# Altium project MISIS_Commutator.PrjPcb
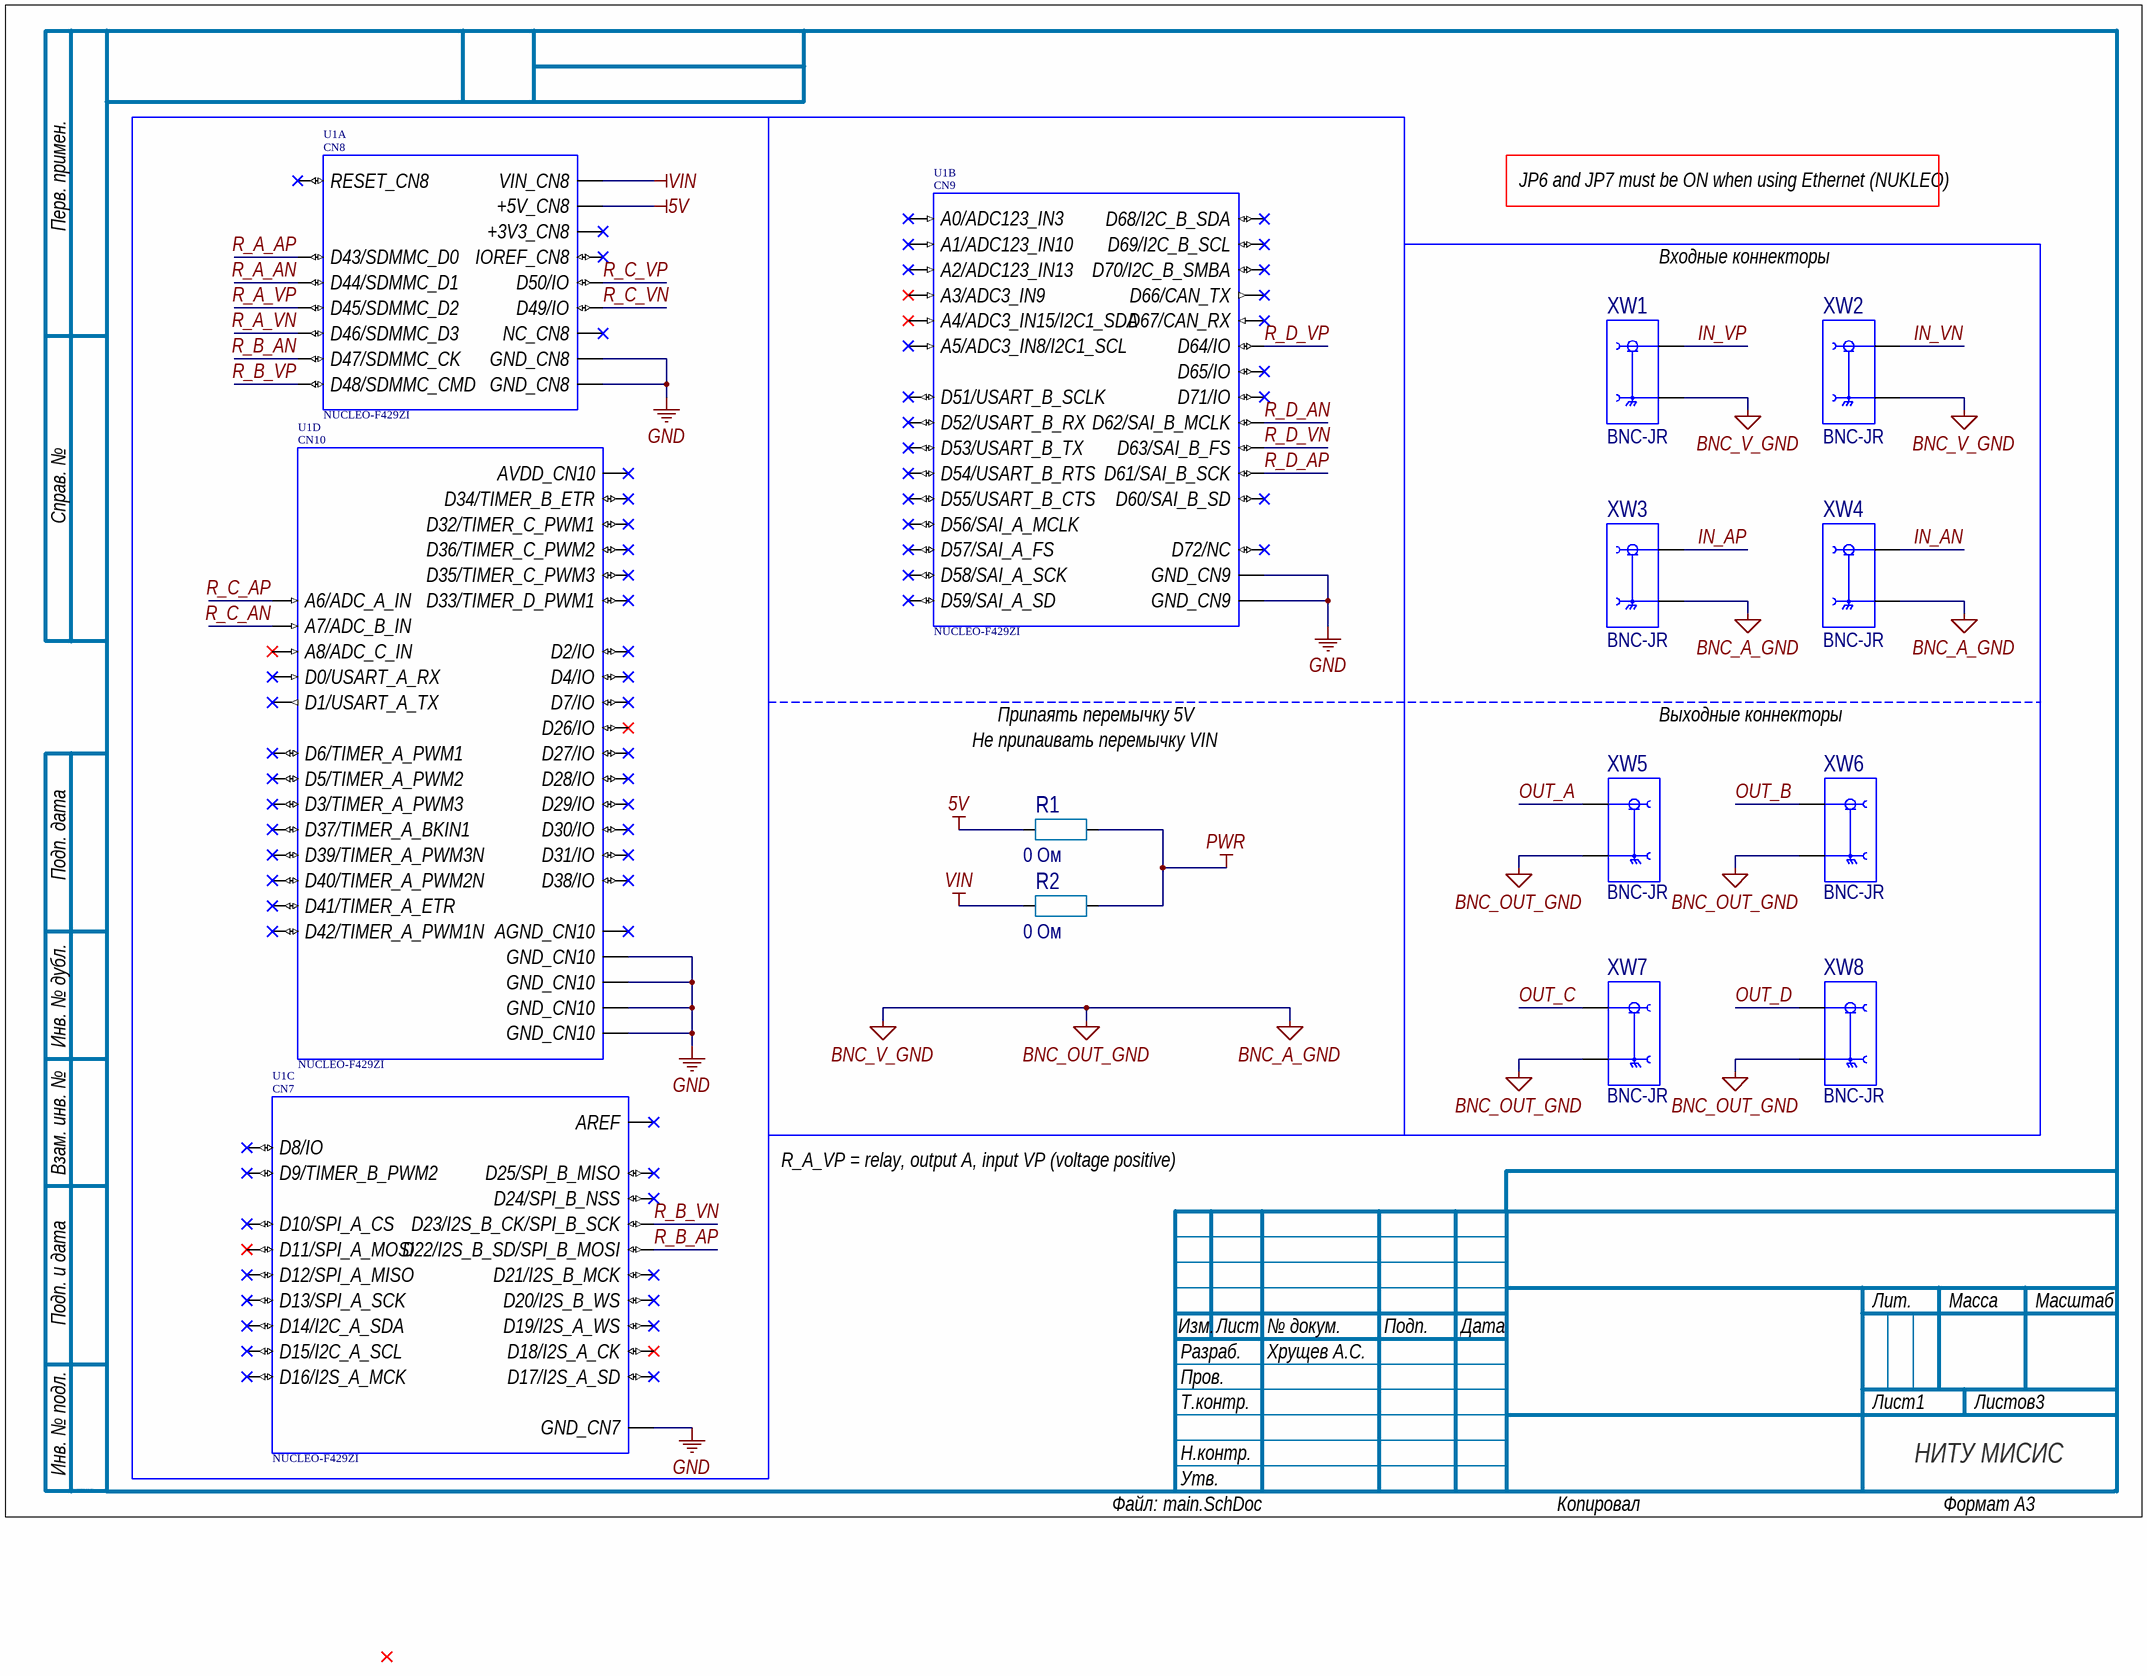
[diagram p0: main.SchDoc]
3 sheets, 75 parts. Net scope: global (net labels, ports and power ports of the same name join across sheets).
Board file: PCB.PcbDoc
Sheets:
  main.SchDoc
  IN_A.SchDoc
  IN_V.SchDoc

## Sheet main.SchDoc
size 420 x 297 mm; Author: ALTIUM GOSTBOM2.0 KEV; SheetNumber: 1; SheetTotal: 3; Наименование_организации: НИТУ МИСИС; п_Разраб_Р: Хрущев А.С.

### Parts
R1  0 Ом  [R0805]
R2  0 Ом  [R0805]
U1  NUCLEO-F429ZI  [MODULE_NUCLEO-F429ZI]  (parts A,B,C,D of 4)
XW1  BNC-JR  [TE_227161-1]
XW2  BNC-JR  [TE_227161-1]
XW3  BNC-JR  [TE_227161-1]
XW4  BNC-JR  [TE_227161-1]
XW5  BNC-JR  [TE_227161-1]
XW6  BNC-JR  [TE_227161-1]
XW7  BNC-JR  [TE_227161-1]
XW8  BNC-JR  [TE_227161-1]

### Nets
5V: R1.1 U1.CN8_9(+5V_CN8)
BNC_A_GND: XW1.2(GND) XW2.2(GND) XW3.2(GND) XW4.2(GND) XW5.2(GND) XW6.2(GND) XW7.2(GND) XW8.2(GND)  [also labelled BNC_OUT_GND, BNC_V_GND]
GND: U1.CN7_8(GND_CN7) U1.CN8_11(GND_CN8) U1.CN8_13(GND_CN8) U1.CN9_12(GND_CN9) U1.CN9_23(GND_CN9) U1.CN10_5(GND_CN10) U1.CN10_17(GND_CN10) U1.CN10_22(GND_CN10) U1.CN10_27(GND_CN10)
PWR: R1.2 R2.2
VIN: R2.1 U1.CN8_15(VIN_CN8)
IN_AN: XW4.1(SIG)
IN_AP: XW3.1(SIG)
IN_VN: XW2.1(SIG)
IN_VP: XW1.1(SIG)
OUT_A: XW5.1(SIG)
OUT_B: XW6.1(SIG)
OUT_C: XW7.1(SIG)
OUT_D: XW8.1(SIG)
R_A_AN: U1.CN8_4(D44/SDMMC_D1)
R_A_AP: U1.CN8_2(D43/SDMMC_D0)
R_A_VN: U1.CN8_8(D46/SDMMC_D3)
R_A_VP: U1.CN8_6(D45/SDMMC_D2)
R_B_AN: U1.CN8_10(D47/SDMMC_CK)
R_B_AP: U1.CN7_13(D22/I2S_B_SD/SPI_B_MOSI)
R_B_VN: U1.CN7_15(D23/I2S_B_CK/SPI_B_SCK)
R_B_VP: U1.CN8_12(D48/SDMMC_CMD)
R_C_AN: U1.CN10_9(A7/ADC_B_IN)
R_C_AP: U1.CN10_7(A6/ADC_A_IN)
R_C_VN: U1.CN8_14(D49/IO)
R_C_VP: U1.CN8_16(D50/IO)
R_D_AN: U1.CN9_26(D62/SAI_B_MCLK)
R_D_AP: U1.CN9_24(D61/SAI_B_SCK)
R_D_VN: U1.CN9_28(D63/SAI_B_FS)
R_D_VP: U1.CN9_30(D64/IO)

Not connected (* = marked no-connect by the designer): U1 CN7_1(D16/I2S_A_MCK)* CN7_2(D15/I2C_A_SCL)* CN7_3(D17/I2S_A_SD)* CN7_4(D14/I2C_A_SDA)* CN7_5(D18/I2S_A_CK)* CN7_6(AREF)* CN7_7(D19/I2S_A_WS)* CN7_9(D20/I2S_B_WS)* CN7_10(D13/SPI_A_SCK)* CN7_11(D21/I2S_B_MCK)* CN7_12(D12/SPI_A_MISO)* CN7_14(D11/SPI_A_MOSI)* CN7_16(D10/SPI_A_CS)* CN7_17(D24/SPI_B_NSS)* CN7_18(D9/TIMER_B_PWM2)* CN7_19(D25/SPI_B_MISO)* CN7_20(D8/IO)* CN8_1(NC_CN8)* CN8_3(IOREF_CN8)* CN8_5(RESET_CN8)* CN8_7(+3V3_CN8)* CN9_1(A0/ADC123_IN3)* CN9_2(D51/USART_B_SCLK)* CN9_3(A1/ADC123_IN10)* CN9_4(D52/USART_B_RX)* CN9_5(A2/ADC123_IN13)* CN9_6(D53/USART_B_TX)* CN9_7(A3/ADC3_IN9)* CN9_8(D54/USART_B_RTS)* CN9_9(A4/ADC3_IN15/I2C1_SDA)* CN9_10(D55/USART_B_CTS)* CN9_11(A5/ADC3_IN8/I2C1_SCL)* CN9_13(D72/NC)* CN9_14(D56/SAI_A_MCLK)* CN9_15(D71/IO)* CN9_16(D57/SAI_A_FS)* CN9_17(D70/I2C_B_SMBA)* CN9_18(D58/SAI_A_SCK)* CN9_19(D69/I2C_B_SCL)* CN9_20(D59/SAI_A_SD)* CN9_21(D68/I2C_B_SDA)* CN9_22(D60/SAI_B_SD)* CN9_25(D67/CAN_RX)* CN9_27(D66/CAN_TX)* CN9_29(D65/IO)* CN10_1(AVDD_CN10)* CN10_2(D7/IO)* CN10_3(AGND_CN10)* CN10_4(D6/TIMER_A_PWM1)* CN10_6(D5/TIMER_A_PWM2)* CN10_8(D4/IO)* CN10_10(D3/TIMER_A_PWM3)* CN10_11(A8/ADC_C_IN)* CN10_12(D2/IO)* CN10_13(D26/IO)* CN10_14(D1/USART_A_TX)* CN10_15(D27/IO)* CN10_16(D0/USART_A_RX)* CN10_18(D42/TIMER_A_PWM1N)* CN10_19(D28/IO)* CN10_20(D41/TIMER_A_ETR)* CN10_21(D29/IO)* CN10_23(D30/IO)* CN10_24(D40/TIMER_A_PWM2N)* CN10_25(D31/IO)* CN10_26(D39/TIMER_A_PWM3N)* CN10_28(D38/IO)* CN10_29(D32/TIMER_C_PWM1)* CN10_30(D37/TIMER_A_BKIN1)* CN10_31(D33/TIMER_D_PWM1)* CN10_32(D36/TIMER_C_PWM2)* CN10_33(D34/TIMER_B_ETR)* CN10_34(D35/TIMER_C_PWM3)*

### Notes on the sheet
- JP6 and JP7 must be ON when using Ethernet (NUKLEO)
- Входные коннекторы
- Не припаивать перемычку VIN
- Припаять перемычку 5V
- Выходные коннекторы
- R_A_VP = relay, output A, input VP (voltage positive)
- Перв. примен.
- Справ. №
- Подп. дата
- Инв. № дубл.
- Взам. инв. №
- Подп. и дата
- Изм.
- Разраб.
- Лист
- № докум.
- Подп.
- Дата
- Лит.
- Масса
- Масштаб
- Пров.
- Т.контр.
- Листов
- Инв. № подл.
- Н.контр.
- Утв.
- ALTIUM GOSTBOM2.0 KEV
- Файл:
- Копировал
- Формат А3
- (in symbol NUCLEO-F429ZI, part A) CN8
- (in symbol NUCLEO-F429ZI, part B) CN9
- (in symbol NUCLEO-F429ZI, part C) CN7
- (in symbol NUCLEO-F429ZI, part D) CN10

### Library data of the parts
R1 R2 = R1_POSTOYANNYJ: Резистор 0 Ом; Value: 0 Ом
U1 = NUCLEO-F429ZI: STM32F429ZI, mbed-Enabled Development Nucleo-144 STM32F4 ARMÂ® CortexÂ®-M4 MCU 32-Bit Embedded Evaluation Board; MF: STMicroelectronics; SnapEDA_Link: https://www.snapeda.com/parts/NUCLEO-F429ZI/STMicroelectronics/view-part/?ref=snap; Package: None; Value: *; MP: NUCLEO-F429ZI; Check_prices: https://www.snapeda.com/parts/NUCLEO-F429ZI/STMicroelectronics/view-part/?ref=eda
XW1-XW8 = BNC-JR: Разъём высокочастотный RUICHI BNC-JR, гнездо на плату; MP: 227161-1; Package: None; Price: None; Value: *; Availability: Unavailable; Supplier 1: DigiKey; Supplier Part Number 1: 900-0731713061-ND

## Sheet IN_A.SchDoc
size 420 x 297 mm; Author: ALTIUM GOSTBOM2.0 KEV; SheetNumber: 2; SheetTotal: 3; Наименование_организации: НИТУ МИСИС; п_Разраб_Р: Хрущев А.С.
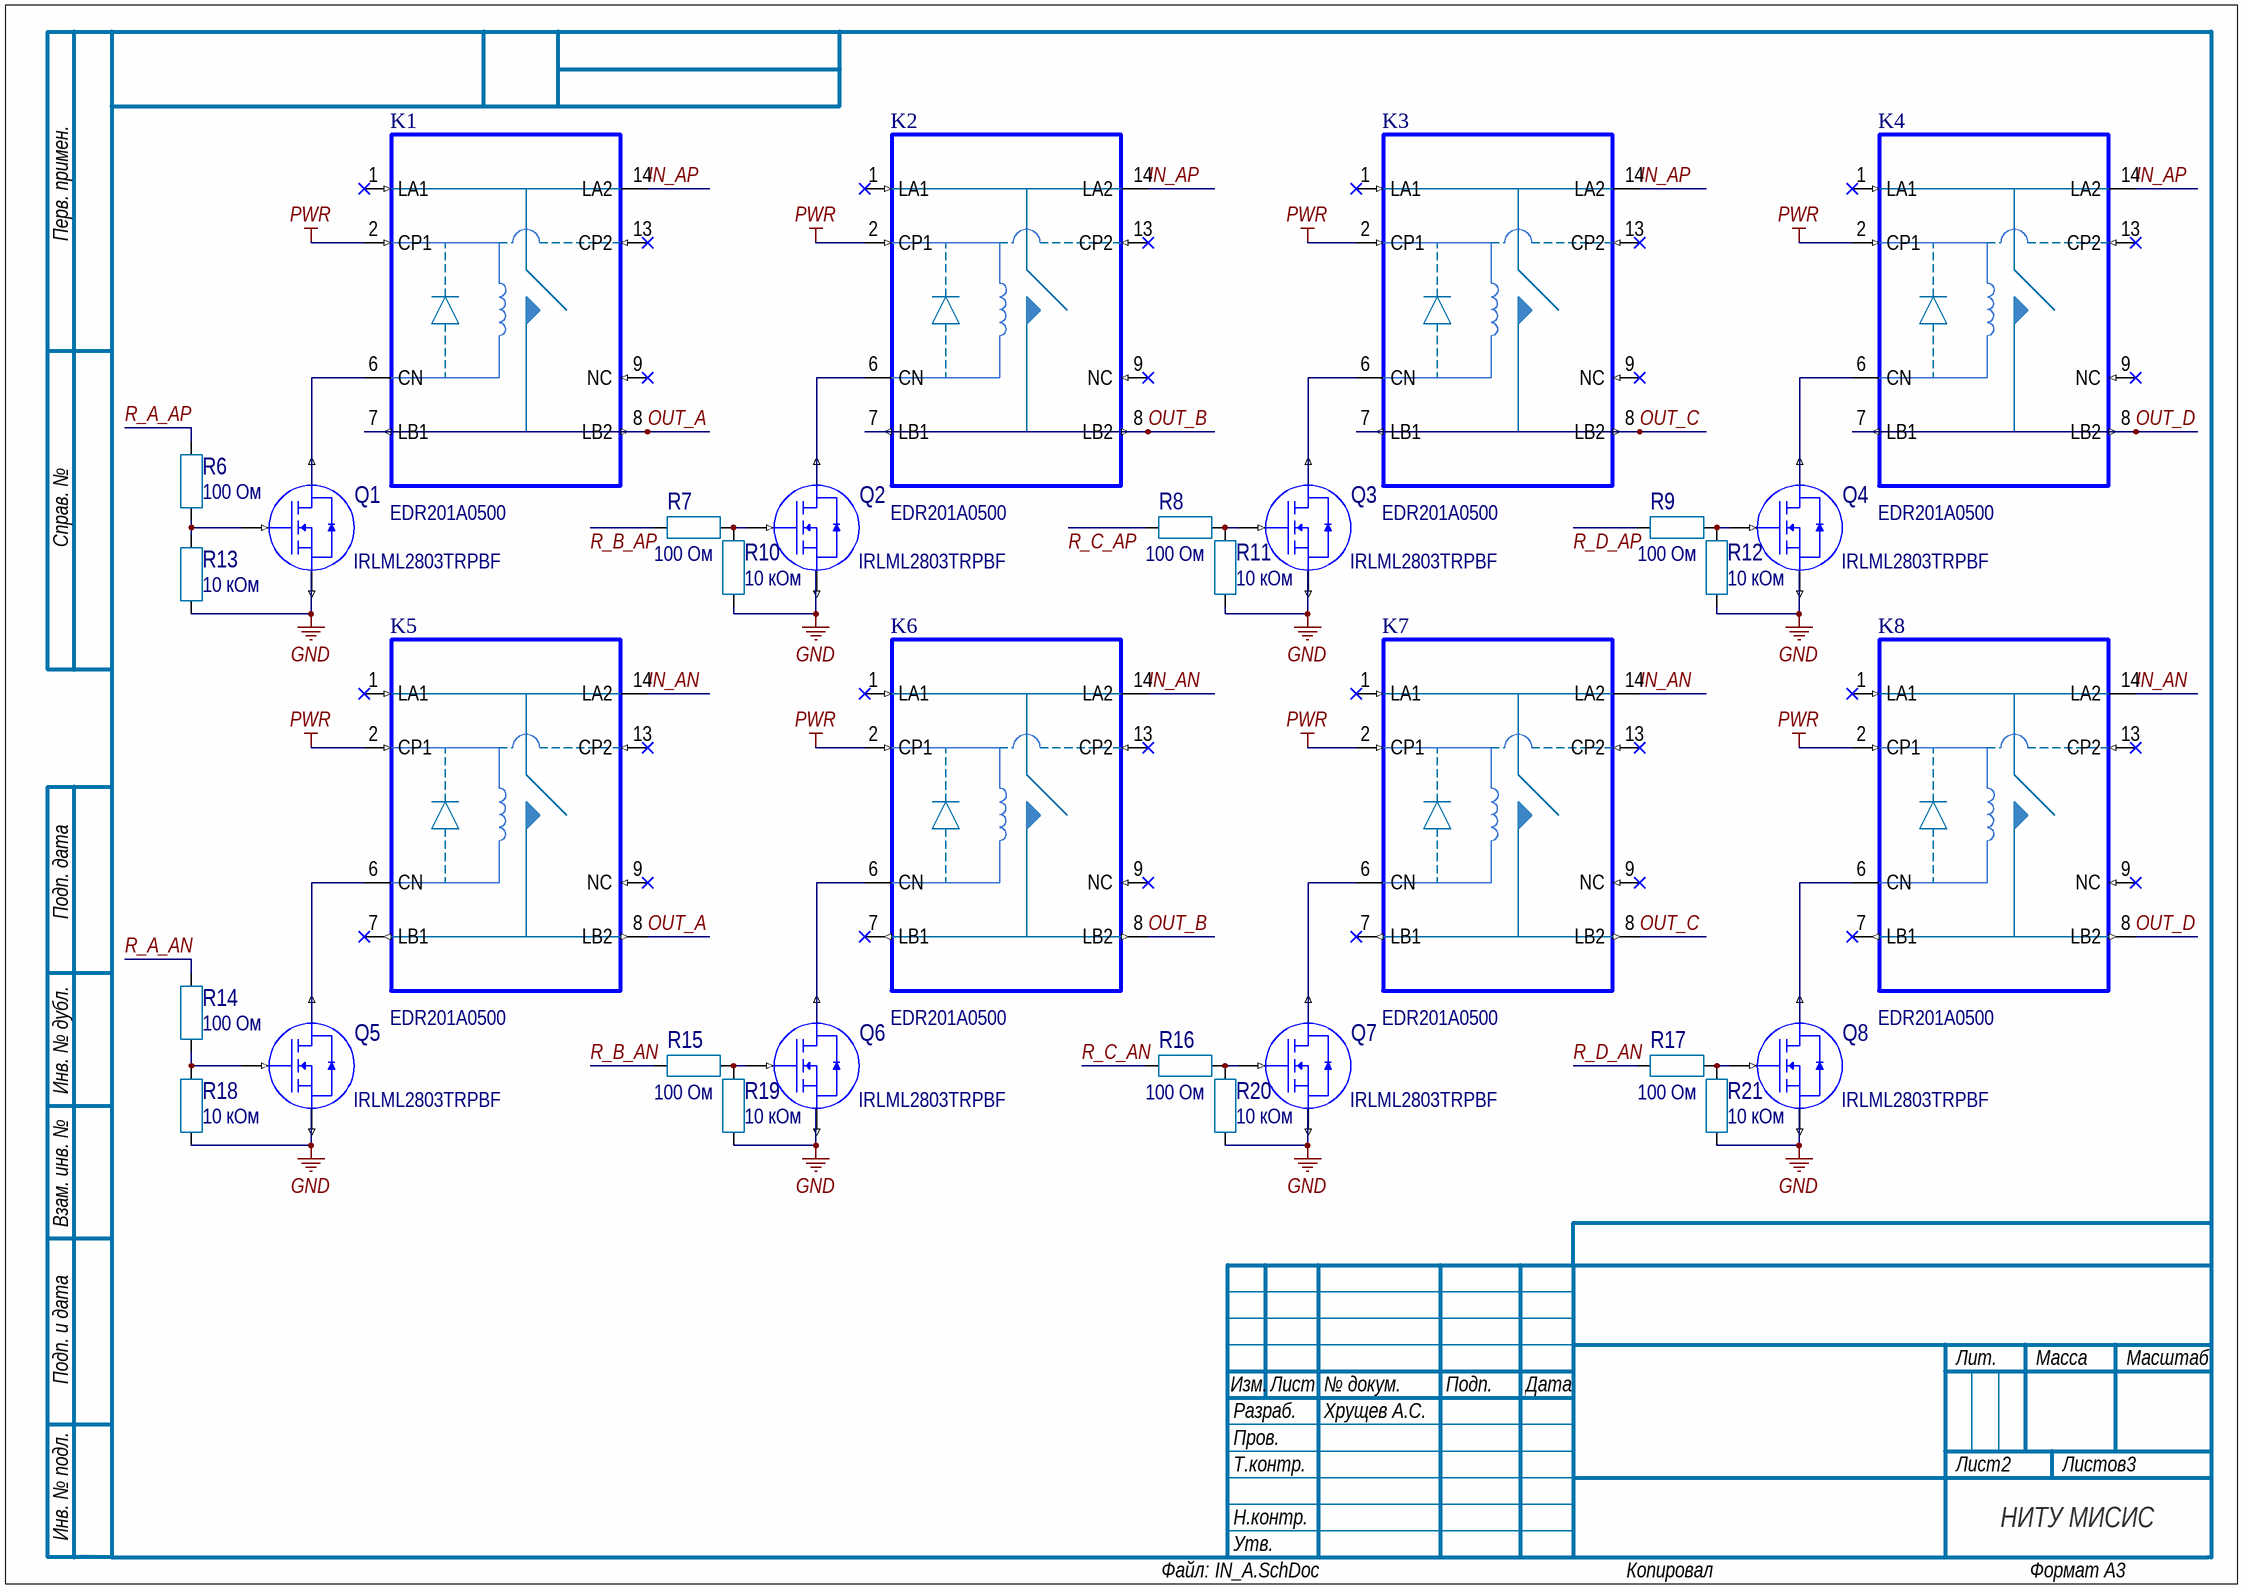
[diagram p1: IN_A.SchDoc]

### Parts
K1  EDR201A0500  [DIP14]
K2  EDR201A0500  [DIP14]
K3  EDR201A0500  [DIP14]
K4  EDR201A0500  [DIP14]
K5  EDR201A0500  [DIP14]
K6  EDR201A0500  [DIP14]
K7  EDR201A0500  [DIP14]
K8  EDR201A0500  [DIP14]
Q1  IRLML2803TRPBF  [SOT23-3]
Q2  IRLML2803TRPBF  [SOT23-3]
Q3  IRLML2803TRPBF  [SOT23-3]
Q4  IRLML2803TRPBF  [SOT23-3]
Q5  IRLML2803TRPBF  [SOT23-3]
Q6  IRLML2803TRPBF  [SOT23-3]
Q7  IRLML2803TRPBF  [SOT23-3]
Q8  IRLML2803TRPBF  [SOT23-3]
R6  100 Ом  [R0805]
R7  100 Ом  [R0805]
R8  100 Ом  [R0805]
R9  100 Ом  [R0805]
R10  10 кОм  [R0805]
R11  10 кОм  [R0805]
R12  10 кОм  [R0805]
R13  10 кОм  [R0805]
R14  100 Ом  [R0805]
R15  100 Ом  [R0805]
R16  100 Ом  [R0805]
R17  100 Ом  [R0805]
R18  10 кОм  [R0805]
R19  10 кОм  [R0805]
R20  10 кОм  [R0805]
R21  10 кОм  [R0805]

### Nets
GND: Q1.2(S) Q2.2(S) Q3.2(S) Q4.2(S) Q5.2(S) Q6.2(S) Q7.2(S) Q8.2(S) R10.1 R11.1 R12.1 R13.1 R18.1 R19.1 R20.1 R21.1
PWR: K1.2(CP1) K2.2(CP1) K3.2(CP1) K4.2(CP1) K5.2(CP1) K6.2(CP1) K7.2(CP1) K8.2(CP1)
IN_AN: K5.14(LA2) K6.14(LA2) K7.14(LA2) K8.14(LA2)
IN_AP: K1.14(LA2) K2.14(LA2) K3.14(LA2) K4.14(LA2)
OUT_A: K1.7(LB1) K1.8(LB2) K5.8(LB2)
OUT_B: K2.7(LB1) K2.8(LB2) K6.8(LB2)
OUT_C: K3.7(LB1) K3.8(LB2) K7.8(LB2)
OUT_D: K4.7(LB1) K4.8(LB2) K8.8(LB2)
R_A_AN: R14.2
R_A_AP: R6.2
R_B_AN: R15.1
R_B_AP: R7.1
R_C_AN: R16.1
R_C_AP: R8.1
R_D_AN: R17.1
R_D_AP: R9.1
NetK1_6: K1.6(CN) Q1.3(D)
NetK2_6: K2.6(CN) Q2.3(D)
NetK3_6: K3.6(CN) Q3.3(D)
NetK4_6: K4.6(CN) Q4.3(D)
NetK5_6: K5.6(CN) Q5.3(D)
NetK6_6: K6.6(CN) Q6.3(D)
NetK7_6: K7.6(CN) Q7.3(D)
NetK8_6: K8.6(CN) Q8.3(D)
NetQ1_1: Q1.1(G) R6.1 R13.2
NetQ2_1: Q2.1(G) R7.2 R10.2
NetQ3_1: Q3.1(G) R8.2 R11.2
NetQ4_1: Q4.1(G) R9.2 R12.2
NetQ5_1: Q5.1(G) R14.1 R18.2
NetQ6_1: Q6.1(G) R15.2 R19.2
NetQ7_1: Q7.1(G) R16.2 R20.2
NetQ8_1: Q8.1(G) R17.2 R21.2

Not connected (* = marked no-connect by the designer): K1 1(LA1)* 9(NC)* 13(CP2)*; K2 1(LA1)* 9(NC)* 13(CP2)*; K3 1(LA1)* 9(NC)* 13(CP2)*; K4 1(LA1)* 9(NC)* 13(CP2)*; K5 1(LA1)* 7(LB1)* 9(NC)* 13(CP2)*; K6 1(LA1)* 7(LB1)* 9(NC)* 13(CP2)*; K7 1(LA1)* 7(LB1)* 9(NC)* 13(CP2)*; K8 1(LA1)* 7(LB1)* 9(NC)* 13(CP2)*

### Notes on the sheet
- Перв. примен.
- Справ. №
- Подп. дата
- Инв. № дубл.
- Взам. инв. №
- Подп. и дата
- Изм.
- Разраб.
- Лист
- № докум.
- Подп.
- Дата
- Лит.
- Масса
- Масштаб
- Пров.
- Т.контр.
- Листов
- Инв. № подл.
- Н.контр.
- Утв.
- ALTIUM GOSTBOM2.0 KEV
- Файл:
- Копировал
- Формат А3

### Library data of the parts
K1-K8 = EDR201A0500: Реле герконовое 5V / 1A,100V; MF: Fairchild Semiconductor; MP: MM74HC32N; SnapEDA_Link: https://www.snapeda.com/parts/MM74HC32N/Fairchild+Imaging/view-part/?ref=snap; Package: DIP-14 Fairchild Semiconductor; Value: *; Check_prices: https://www.snapeda.com/parts/MM74HC32N/Fairchild+Imaging/view-part/?ref=eda
Q1-Q8 = IRLML2803TRPBF: N-MOSFET 30V 1.2A SOT23; Supplier 1: Future Electronics; Supplier Part Number 1: 1173882
R6-R9 R14-R17 = R1_POSTOYANNYJ: Резистор 100 Ом; Value: 100 Ом
R10-R13 R18-R21 = R1_POSTOYANNYJ: Резистор 100 Ом; Value: 100 Ом

## Sheet IN_V.SchDoc
size 420 x 297 mm; Author: ALTIUM GOSTBOM2.0 KEV; SheetNumber: 3; SheetTotal: 3; Наименование_организации: НИТУ МИСИС; п_Разраб_Р: Хрущев А.С.
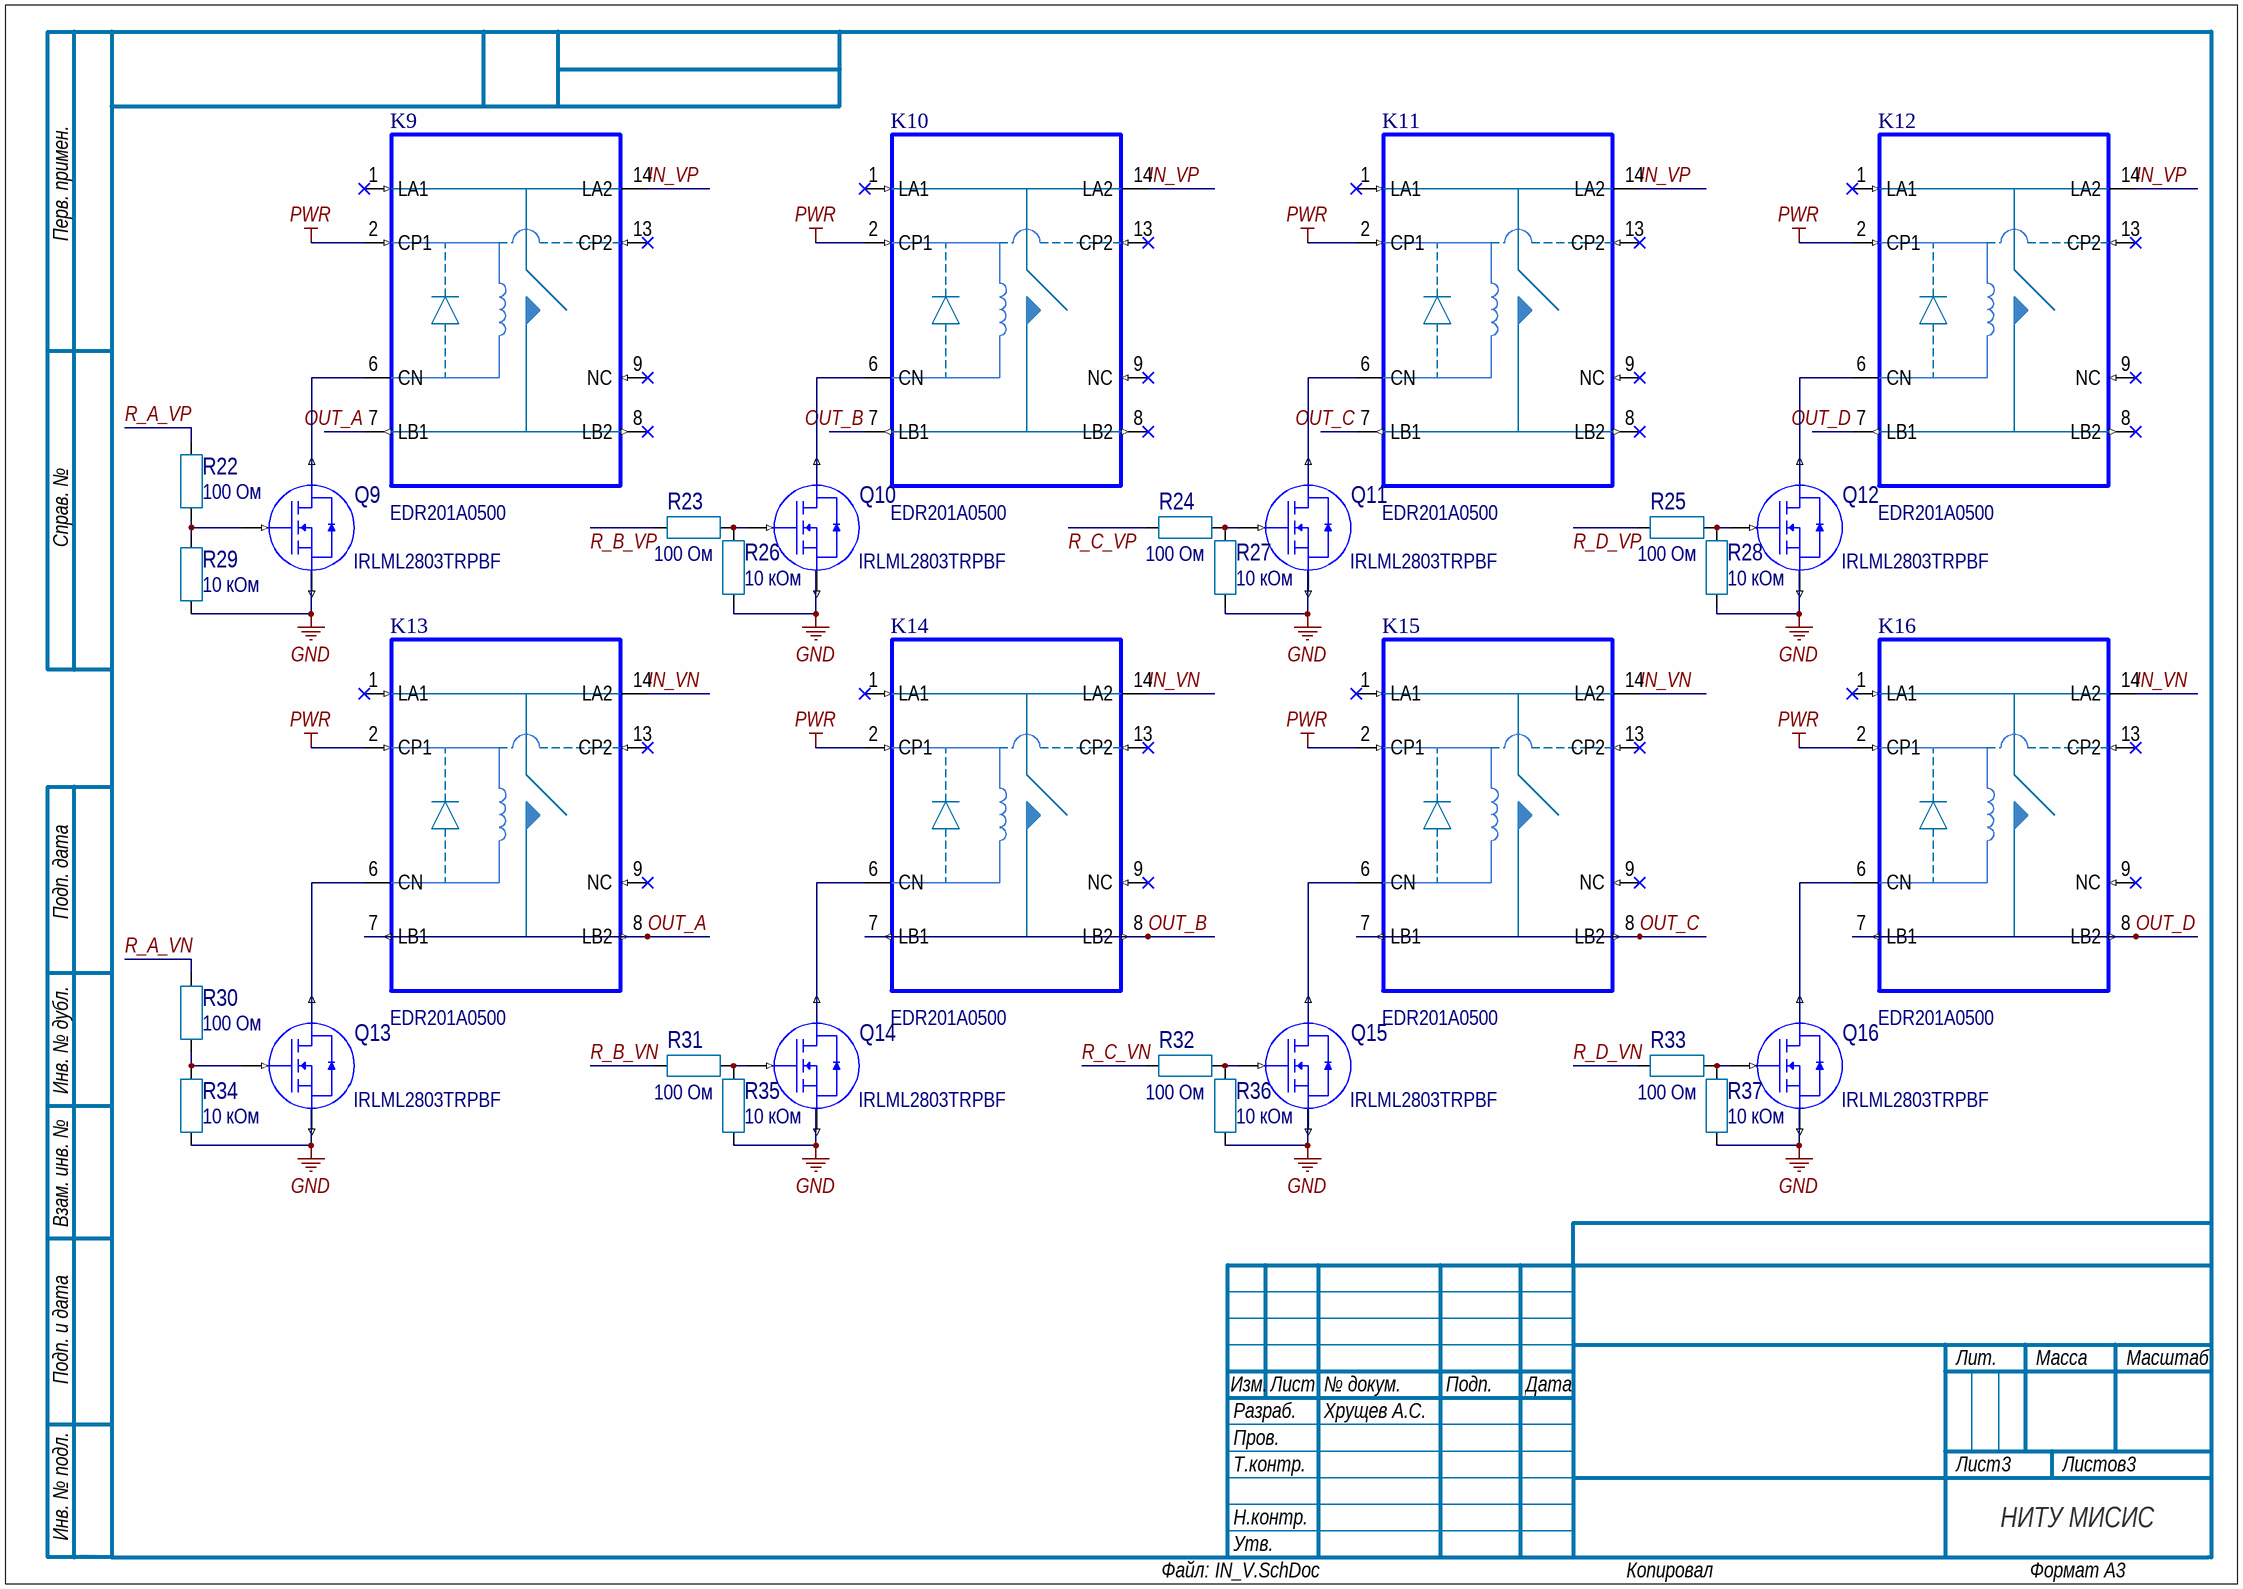
[diagram p2: IN_V.SchDoc]

### Parts
K9  EDR201A0500  [DIP14]
K10  EDR201A0500  [DIP14]
K11  EDR201A0500  [DIP14]
K12  EDR201A0500  [DIP14]
K13  EDR201A0500  [DIP14]
K14  EDR201A0500  [DIP14]
K15  EDR201A0500  [DIP14]
K16  EDR201A0500  [DIP14]
Q9  IRLML2803TRPBF  [SOT23-3]
Q10  IRLML2803TRPBF  [SOT23-3]
Q11  IRLML2803TRPBF  [SOT23-3]
Q12  IRLML2803TRPBF  [SOT23-3]
Q13  IRLML2803TRPBF  [SOT23-3]
Q14  IRLML2803TRPBF  [SOT23-3]
Q15  IRLML2803TRPBF  [SOT23-3]
Q16  IRLML2803TRPBF  [SOT23-3]
R22  100 Ом  [R0805]
R23  100 Ом  [R0805]
R24  100 Ом  [R0805]
R25  100 Ом  [R0805]
R26  10 кОм  [R0805]
R27  10 кОм  [R0805]
R28  10 кОм  [R0805]
R29  10 кОм  [R0805]
R30  100 Ом  [R0805]
R31  100 Ом  [R0805]
R32  100 Ом  [R0805]
R33  100 Ом  [R0805]
R34  10 кОм  [R0805]
R35  10 кОм  [R0805]
R36  10 кОм  [R0805]
R37  10 кОм  [R0805]

### Nets
GND: Q9.2(S) Q10.2(S) Q11.2(S) Q12.2(S) Q13.2(S) Q14.2(S) Q15.2(S) Q16.2(S) R26.1 R27.1 R28.1 R29.1 R34.1 R35.1 R36.1 R37.1
PWR: K9.2(CP1) K10.2(CP1) K11.2(CP1) K12.2(CP1) K13.2(CP1) K14.2(CP1) K15.2(CP1) K16.2(CP1)
IN_VN: K13.14(LA2) K14.14(LA2) K15.14(LA2) K16.14(LA2)
IN_VP: K9.14(LA2) K10.14(LA2) K11.14(LA2) K12.14(LA2)
OUT_A: K9.7(LB1) K13.7(LB1) K13.8(LB2)
OUT_B: K10.7(LB1) K14.7(LB1) K14.8(LB2)
OUT_C: K11.7(LB1) K15.7(LB1) K15.8(LB2)
OUT_D: K12.7(LB1) K16.7(LB1) K16.8(LB2)
R_A_VN: R30.2
R_A_VP: R22.2
R_B_VN: R31.1
R_B_VP: R23.1
R_C_VN: R32.1
R_C_VP: R24.1
R_D_VN: R33.1
R_D_VP: R25.1
NetK9_6: K9.6(CN) Q9.3(D)
NetK10_6: K10.6(CN) Q10.3(D)
NetK11_6: K11.6(CN) Q11.3(D)
NetK12_6: K12.6(CN) Q12.3(D)
NetK13_6: K13.6(CN) Q13.3(D)
NetK14_6: K14.6(CN) Q14.3(D)
NetK15_6: K15.6(CN) Q15.3(D)
NetK16_6: K16.6(CN) Q16.3(D)
NetQ9_1: Q9.1(G) R22.1 R29.2
NetQ10_1: Q10.1(G) R23.2 R26.2
NetQ11_1: Q11.1(G) R24.2 R27.2
NetQ12_1: Q12.1(G) R25.2 R28.2
NetQ13_1: Q13.1(G) R30.1 R34.2
NetQ14_1: Q14.1(G) R31.2 R35.2
NetQ15_1: Q15.1(G) R32.2 R36.2
NetQ16_1: Q16.1(G) R33.2 R37.2

Not connected (* = marked no-connect by the designer): K9 1(LA1)* 8(LB2)* 9(NC)* 13(CP2)*; K10 1(LA1)* 8(LB2)* 9(NC)* 13(CP2)*; K11 1(LA1)* 8(LB2)* 9(NC)* 13(CP2)*; K12 1(LA1)* 8(LB2)* 9(NC)* 13(CP2)*; K13 1(LA1)* 9(NC)* 13(CP2)*; K14 1(LA1)* 9(NC)* 13(CP2)*; K15 1(LA1)* 9(NC)* 13(CP2)*; K16 1(LA1)* 9(NC)* 13(CP2)*

### Notes on the sheet
- Перв. примен.
- Справ. №
- Подп. дата
- Инв. № дубл.
- Взам. инв. №
- Подп. и дата
- Изм.
- Разраб.
- Лист
- № докум.
- Подп.
- Дата
- Лит.
- Масса
- Масштаб
- Пров.
- Т.контр.
- Листов
- Инв. № подл.
- Н.контр.
- Утв.
- ALTIUM GOSTBOM2.0 KEV
- Файл:
- Копировал
- Формат А3

### Library data of the parts
K9-K16 = EDR201A0500: as K1 on sheet IN_A; SnapEDA_Link: https://www.snapeda.com/parts/MM74HC32N/Fairchild+Imaging/view-part/?ref=snap; Package: DIP-14 Fairchild Semiconductor; Value: *; Check_prices: https://www.snapeda.com/parts/MM74HC32N/Fairchild+Imaging/view-part/?ref=eda
Q9-Q16 = IRLML2803TRPBF: N-MOSFET 30V 1.2A SOT23; Supplier 1: Future Electronics; Supplier Part Number 1: 1173882
R22-R25 R30-R33 = R1_POSTOYANNYJ: Резистор 100 Ом; Value: 100 Ом
R26-R29 R34-R37 = R1_POSTOYANNYJ: Резистор 100 Ом; Value: 100 Ом

## Nets that join several sheets
GND: main (9 pins), IN_A (16 pins), IN_V (16 pins)
PWR: main (R1.2 R2.2), IN_A (8 pins), IN_V (8 pins)
IN_AN: main (XW4.1), IN_A (K5.14 K6.14 K7.14 K8.14)
IN_AP: main (XW3.1), IN_A (K1.14 K2.14 K3.14 K4.14)
IN_VN: main (XW2.1), IN_V (K13.14 K14.14 K15.14 K16.14)
IN_VP: main (XW1.1), IN_V (K9.14 K10.14 K11.14 K12.14)
OUT_A: main (XW5.1), IN_A (K1.7 K1.8 K5.8), IN_V (K9.7 K13.7 K13.8)
OUT_B: main (XW6.1), IN_A (K2.7 K2.8 K6.8), IN_V (K10.7 K14.7 K14.8)
OUT_C: main (XW7.1), IN_A (K3.7 K3.8 K7.8), IN_V (K11.7 K15.7 K15.8)
OUT_D: main (XW8.1), IN_A (K4.7 K4.8 K8.8), IN_V (K12.7 K16.7 K16.8)
R_A_AN: main (U1.CN8_4), IN_A (R14.2)
R_A_AP: main (U1.CN8_2), IN_A (R6.2)
R_A_VN: main (U1.CN8_8), IN_V (R30.2)
R_A_VP: main (U1.CN8_6), IN_V (R22.2)
R_B_AN: main (U1.CN8_10), IN_A (R15.1)
R_B_AP: main (U1.CN7_13), IN_A (R7.1)
R_B_VN: main (U1.CN7_15), IN_V (R31.1)
R_B_VP: main (U1.CN8_12), IN_V (R23.1)
R_C_AN: main (U1.CN10_9), IN_A (R16.1)
R_C_AP: main (U1.CN10_7), IN_A (R8.1)
R_C_VN: main (U1.CN8_14), IN_V (R32.1)
R_C_VP: main (U1.CN8_16), IN_V (R24.1)
R_D_AN: main (U1.CN9_26), IN_A (R17.1)
R_D_AP: main (U1.CN9_24), IN_A (R9.1)
R_D_VN: main (U1.CN9_28), IN_V (R33.1)
R_D_VP: main (U1.CN9_30), IN_V (R25.1)